# Altium schematic sheet OurEDA-P1K_cam.SchDoc
size A4; SheetNumber: 5; SheetTotal: 7
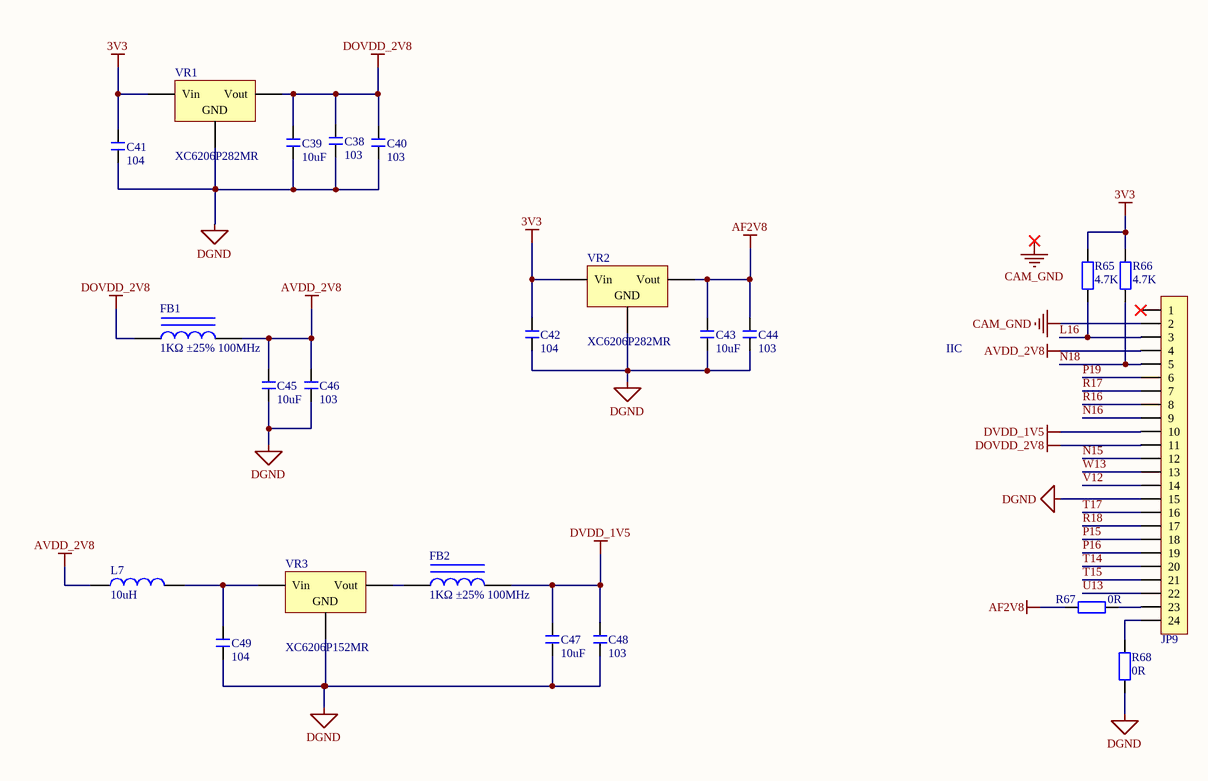
[diagram p0: OurEDA-P1K_cam.SchDoc]

## Parts
C38  103  [C 0603_L]
C39  10uF  [C 0603_L]
C40  103  [C 0603_L]
C41  104  [C 0603_L]
C42  104  [C 0603_L]
C43  10uF  [C 0603_L]
C44  103  [C 0603_L]
C45  10uF  [C 0603_L]
C46  103  [C 0603_L]
C47  10uF  [C 0603_L]
C48  103  [C 0603_L]
C49  104  [C 0603_L]
FB1  1KΩ ±25% 100MHz  [0805_L]
FB2  1KΩ ±25% 100MHz  [0805_L]
JP9  FPC1.0-24P  [FPC0.5 2H-WS-24P]  (value not drawn)
L7  10uH  [L 0805]
R65  4.7K  [R 0603_L]
R66  4.7K  [R 0603_L]
R67  0R  [R 0603_L]
R68  0R  [R 0603_L]
VR1  XC6206P282MR  [SOT-23-3L]
VR2  XC6206P282MR  [SOT-23-3L]
VR3  XC6206P152MR  [SOT-23-3L]

## Nets
3V3: C41.1 C42.1 R65.1 R66.1 VR1.3(Vin) VR2.3(Vin)
AF2V8: C43.1 C44.1 R67.1 VR2.2(Vout)
AVDD_2V8: C45.1 C46.1 FB1.2 JP9.4 L7.1
CAM_GND: JP9.2
DGND: C38.2 C39.2 C40.2 C41.2 C42.2 C43.2 C44.2 C45.2 C46.2 C47.2 C48.2 C49.2 JP9.15 R68.2 VR1.1(GND) VR2.1(GND) VR3.1(GND)
DOVDD_2V8: C38.1 C39.1 C40.1 FB1.1 JP9.11 VR1.2(Vout)
DVDD_1V5: C47.1 C48.1 FB2.2 JP9.10
L16: JP9.3 R65.2
N15: JP9.12
N16: JP9.9
N18: JP9.5 R66.2
P15: JP9.18
P16: JP9.19
P19: JP9.6
R16: JP9.8
R17: JP9.7
R18: JP9.17
T14: JP9.20
T15: JP9.21
T17: JP9.16
U13: JP9.22
V12: JP9.14
W13: JP9.13
NetC49_1: C49.1 L7.2 VR3.3(Vin)
NetFB2_1: FB2.1 VR3.2(Vout)
NetJP9_23: JP9.23 R67.2
NetJP9_24: JP9.24 R68.1

Not connected (* = marked no-connect by the designer): JP9 1*

## Notes on the sheet
- IIC
- Labels drawn without touching a wire or pin: CAM_GND

## Library data of the parts
C38-C49 = C: 无极性贴片电容; 版权归属: 源创客; BOM名称: 无极性贴片电容; 学习资源: www.ooocke.com
FB1 FB2 = 0805 600Ω 25% 100MHz: 贴片磁珠; ComponentLink1Description: 供应商链接; ComponentLink1URL: http://www.szlcsc.com/product/details_1369.html; Package: 0805; Supplier: LC; SuppliersPartNumber: C1017
JP9 = FPC-24P: FPC连接器; 版权归属: 源创客; BOM名称: FPC连接器; 学习资源: www.ooocke.com
L7 = L: 小功率贴片电感; 版权归属: 源创客; BOM名称: 小功率贴片电感; 学习资源: www.ooocke.com
R65-R68 = R: 贴片电阻; 版权归属: 源创客; BOM名称: 贴片电阻; 学习资源: www.ooocke.com
VR1-VR3 = SOT-23 XC6206P332MR: 低压差线性稳压(LDO); ComponentLink1Description: 供应商链接; ComponentLink1URL: http://www.szlcsc.com/product/details_5896.html; Package: SOT-23; Supplier: LC; SuppliersPartNumber: C5446